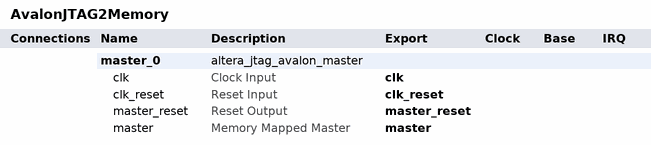
[diagram p0: system contents]
# Platform Designer (Qsys) system AvalonJTAG2Memory, Cyclone V 5CGXFC3B6F23C6
# Parameters at their usual value, and those the tool derives, are not listed.
package require -exact qsys 15.0
create_system AvalonJTAG2Memory
set_project_property DEVICE_FAMILY {Cyclone V}
set_project_property DEVICE 5CGXFC3B6F23C6

add_instance master_0 altera_jtag_avalon_master 15.0
set_instance_property master_0 AUTO_EXPORT true

# exported interfaces
add_interface clk clock sink
set_interface_property clk EXPORT_OF master_0.clk
add_interface clk_reset reset sink
set_interface_property clk_reset EXPORT_OF master_0.clk_reset
add_interface master avalon master
set_interface_property master EXPORT_OF master_0.master
add_interface master_reset reset source
set_interface_property master_reset EXPORT_OF master_0.master_reset

set_interconnect_requirement {$system} qsys_mm.clockCrossingAdapter HANDSHAKE
set_interconnect_requirement {$system} qsys_mm.enableEccProtection FALSE
set_interconnect_requirement {$system} qsys_mm.insertDefaultSlave FALSE
set_interconnect_requirement {$system} qsys_mm.maxAdditionalLatency 1

save_system AvalonJTAG2Memory.qsys
